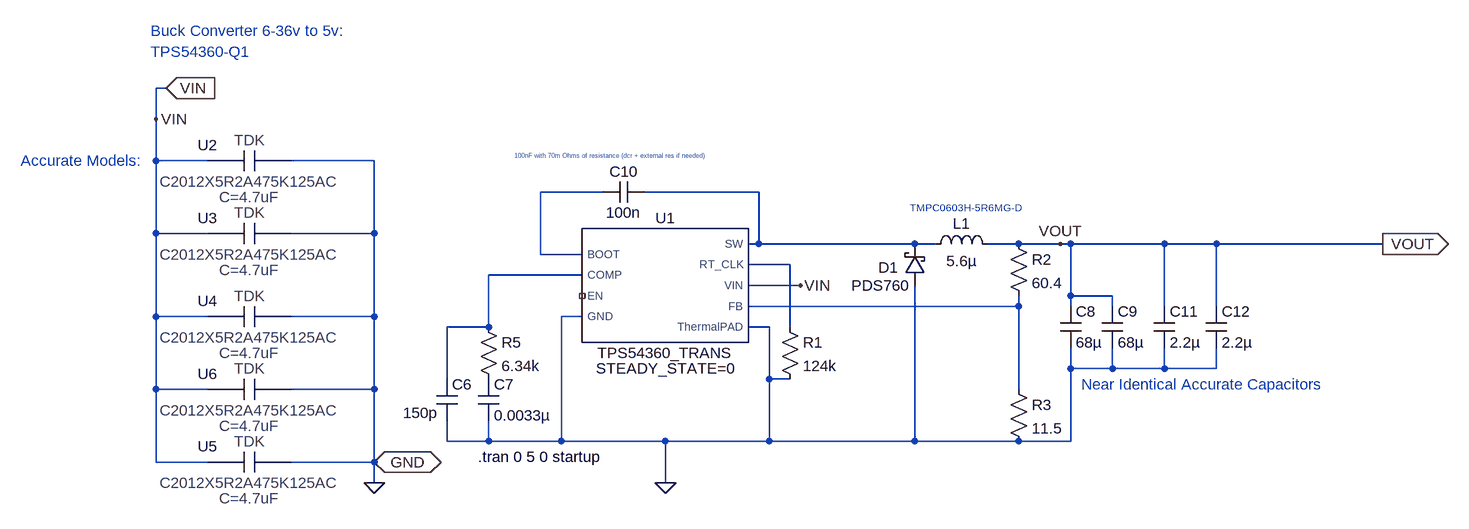
[diagram p0: schematic BuckConverter.asc]
BuckConverter.asc, the LTspice schematic file:
Version 4.1
SHEET 1 1788 988
WIRE -592 -160 -608 -160
WIRE -608 -112 -608 -160
WIRE -608 -48 -608 -112
WIRE -528 -48 -608 -48
WIRE -272 -48 -400 -48
WIRE 80 0 -16 0
WIRE 320 0 144 0
WIRE -608 64 -608 -48
WIRE -528 64 -608 64
WIRE -272 64 -272 -48
WIRE -272 64 -400 64
WIRE 320 80 320 0
WIRE 320 80 304 80
WIRE 560 80 320 80
WIRE 592 80 560 80
WIRE 720 80 672 80
WIRE 784 80 720 80
WIRE 800 80 784 80
WIRE 944 80 800 80
WIRE 1024 80 944 80
WIRE 1280 80 1024 80
WIRE -16 96 -16 0
WIRE 48 96 -16 96
WIRE 368 112 304 112
WIRE 48 128 -96 128
WIRE 384 144 304 144
WIRE 800 160 800 80
WIRE 864 160 800 160
WIRE 720 176 720 160
WIRE 720 176 304 176
WIRE 800 176 800 160
WIRE 864 176 864 160
WIRE 944 176 944 80
WIRE 1024 176 1024 80
WIRE -608 192 -608 64
WIRE -528 192 -608 192
WIRE -272 192 -272 64
WIRE -272 192 -400 192
WIRE 48 192 16 192
WIRE -96 208 -96 128
WIRE -96 208 -160 208
WIRE 336 208 304 208
WIRE 368 208 368 112
WIRE 800 272 800 240
WIRE 864 272 864 240
WIRE 864 272 800 272
WIRE 944 272 944 240
WIRE 944 272 864 272
WIRE 1024 272 1024 240
WIRE 1024 272 944 272
WIRE -160 288 -160 208
WIRE 336 288 336 208
WIRE 368 288 336 288
WIRE -608 304 -608 192
WIRE -528 304 -608 304
WIRE -272 304 -272 192
WIRE -272 304 -400 304
WIRE 720 304 720 176
WIRE -160 384 -160 352
WIRE -96 384 -96 352
WIRE -96 384 -160 384
WIRE 16 384 16 192
WIRE 16 384 -96 384
WIRE 176 384 16 384
WIRE 336 384 336 288
WIRE 336 384 176 384
WIRE 560 384 560 144
WIRE 560 384 336 384
WIRE 720 384 560 384
WIRE 800 384 800 272
WIRE 800 384 720 384
WIRE -608 416 -608 304
WIRE -528 416 -608 416
WIRE -272 416 -272 304
WIRE -272 416 -400 416
WIRE -272 448 -272 416
WIRE 176 448 176 384
FLAG 176 448 0
FLAG -592 -160 VIN
IOPIN -592 -160 In
FLAG -272 448 0
FLAG 784 80 VOUT
FLAG -272 416 GND
IOPIN -272 416 BiDir
FLAG 1280 80 VOUT
IOPIN 1280 80 Out
FLAG 384 144 VIN
FLAG -608 -112 VIN
SYMBOL TPS54360_TRANS 176 144 R0
SYMATTR InstName U1
SYMBOL cap 144 -16 R90
WINDOW 0 0 32 VBottom 2
WINDOW 3 32 32 VTop 2
SYMATTR InstName C10
SYMATTR Value 100n
SYMATTR SpiceLine V=50 Rser=70m
SYMBOL res 352 192 R0
SYMATTR InstName R1
SYMATTR Value 124k
SYMATTR SpiceLine tol=1 pwr=0.25
SYMBOL schottky 576 144 R180
WINDOW 0 41 28 Left 2
WINDOW 3 24 0 Left 2
SYMATTR InstName D1
SYMATTR Value PDS760
SYMATTR Description Diode
SYMATTR Type diode
SYMBOL cap 784 176 R0
SYMATTR Value 68µ
SYMATTR InstName C8
SYMATTR SpiceLine V=50 Irms=400m Rser=0.071 Lser=10n mfg="Würth Elektronik" pn="860080674007 WCAP-ATLI 8x11,5" type="Al electrolytic"
SYMBOL cap 848 176 R0
SYMATTR Value 68µ
SYMATTR InstName C9
SYMATTR SpiceLine V=50 Irms=400m Rser=0.071 Lser=10n mfg="Würth Elektronik" pn="860080674007 WCAP-ATLI 8x11,5" type="Al electrolytic"
SYMBOL res 704 64 R0
SYMATTR InstName R2
SYMATTR Value 60.4
SYMATTR SpiceLine tol=1
SYMBOL res 704 288 R0
SYMATTR InstName R3
SYMATTR Value 11.5
SYMATTR SpiceLine tol=1
SYMBOL res -112 192 R0
SYMATTR InstName R5
SYMATTR Value 6.34k
SYMATTR SpiceLine tol=1
SYMBOL cap -112 288 R0
SYMATTR InstName C7
SYMATTR Value 0.0033µ
SYMATTR SpiceLine V=50 Irms=0 Rser=0 Lser=0 mfg="Murata" pn="GCM1885C1H332JA16" type="C0G"
SYMBOL cap -176 288 R0
WINDOW 3 -52 52 Left 2
SYMATTR Value 150p
SYMATTR InstName C6
SYMATTR SpiceLine V=50 Irms=0 Rser=0 Lser=0 mfg="Murata" pn="GRM0335C1H151JA01" type="C0G"
SYMBOL cap 928 176 R0
SYMATTR InstName C11
SYMATTR Value 2.2µ
SYMATTR SpiceLine V=16 Irms=0 Rser=0.004 Lser=525p mfg="Würth Elektronik" pn="885012209012 WCAP-CSGP 1210" type="X7R"
SYMBOL cap 1008 176 R0
SYMATTR InstName C12
SYMATTR Value 2.2µ
SYMATTR SpiceLine V=16 Irms=0 Rser=0.004 Lser=525p mfg="Würth Elektronik" pn="885012209012 WCAP-CSGP 1210" type="X7R"
SYMBOL ind 576 96 R270
WINDOW 0 32 56 VTop 2
WINDOW 3 5 56 VBottom 2
SYMATTR InstName L1
SYMATTR Value 5.6µ
SYMATTR SpiceLine Ipk=9A Rser=48m
SYMBOL C2012X5R2A475K125AC_b -464 -48 R0
SYMATTR InstName U2
SYMBOL C2012X5R2A475K125AC_b -464 64 R0
SYMATTR InstName U3
SYMBOL C2012X5R2A475K125AC_b -464 192 R0
SYMATTR InstName U4
SYMBOL C2012X5R2A475K125AC_b -464 304 R0
SYMATTR InstName U6
SYMBOL C2012X5R2A475K125AC_b -464 416 R0
SYMATTR InstName U5
TEXT -112 408 Left 2 !.tran 0 5 0 startup
TEXT -616 -248 Left 2 ;Buck Converter 6-36v to 5v:
TEXT -616 -216 Left 2 ;TPS54360-Q1
TEXT -816 -48 Left 2 ;Accurate Models:
TEXT 816 296 Left 2 ;Near Identical Accurate Capacitors
TEXT 552 24 Left 1 ;TMPC0603H-5R6MG-D
TEXT -56 -56 Left 0 ;100nF with 70m Ohms of resistance (dcr + external res if needed)

The netlist it stands for:
* BuckConverter.asc
X§U1 N001 N004 NC_01 0 N002 N003 VIN N005 0 TPS54360_TRANS STEADY_STATE=0  ; pins BOOT COMP EN GND SW RT_CLK VIN FB ThermalPAD
C10 N002 N001 100n V=50 Rser=70m
R1 N003 0 124k tol=1 pwr=0.25
D1 0 N002 PDS760
C8 VOUT 0 68µ V=50 Irms=400m Rser=0.071 Lser=10n mfg="Würth Elektronik" pn="860080674007 WCAP-ATLI 8x11,5" type="Al electrolytic"
C9 VOUT 0 68µ V=50 Irms=400m Rser=0.071 Lser=10n mfg="Würth Elektronik" pn="860080674007 WCAP-ATLI 8x11,5" type="Al electrolytic"
R2 VOUT N005 60.4 tol=1
R3 N005 0 11.5 tol=1
R5 N004 P001 6.34k tol=1
C7 P001 0 0.0033µ V=50 Irms=0 Rser=0 Lser=0 mfg="Murata" pn="GCM1885C1H332JA16" type="C0G"
C6 N004 0 150p V=50 Irms=0 Rser=0 Lser=0 mfg="Murata" pn="GRM0335C1H151JA01" type="C0G"
C11 VOUT 0 2.2µ V=16 Irms=0 Rser=0.004 Lser=525p mfg="Würth Elektronik" pn="885012209012 WCAP-CSGP 1210" type="X7R"
C12 VOUT 0 2.2µ V=16 Irms=0 Rser=0.004 Lser=525p mfg="Würth Elektronik" pn="885012209012 WCAP-CSGP 1210" type="X7R"
L1 N002 VOUT 5.6µ Ipk=9A Rser=48m
X§U2 VIN 0 C2012X5R2A475K125AC_b  ; pins 1 2
X§U3 VIN 0 C2012X5R2A475K125AC_b  ; pins 1 2
X§U4 VIN 0 C2012X5R2A475K125AC_b  ; pins 1 2
X§U6 VIN 0 C2012X5R2A475K125AC_b  ; pins 1 2
X§U5 VIN 0 C2012X5R2A475K125AC_b  ; pins 1 2
.model D D
.lib standard.dio
.tran 0 5 0 startup
* Buck Converter 6-36v to 5v:
* TPS54360-Q1
* Accurate Models:
* Near Identical Accurate Capacitors
* TMPC0603H-5R6MG-D
* 100nF with 70m Ohms of resistance (dcr + external res if needed)
.lib TPS54360_TRANS.LIB
.lib C2012X5R2A475K125AC_b_LTspice.mod
.backanno
.end